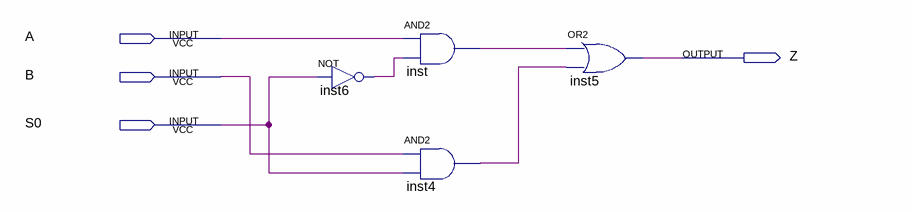
[diagram p0: schematic sheet]
// Quartus schematic MUX_2_1_1BIT.bdf as structural Verilog: 4 symbols, 4 pins
module MUX_2_1_1BIT (
  input  A,
  input  B,
  input  S0,
  output Z
);

  wire inst4_out, inst6_out, inst_out;

  not inst6 (inst6_out, S0);
  and inst (inst_out, A, inst6_out);
  and inst4 (inst4_out, B, S0);
  or inst5 (Z, inst_out, inst4_out);
endmodule
